# Altium project gadapter.PrjPcb
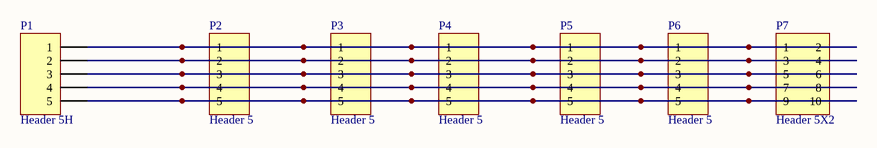
[diagram p0: gadapter.SchDoc]
1 sheet, 7 parts. Net scope: global (net labels, ports and power ports of the same name join across sheets).
Board file: gadapter.PcbDoc

## Sheet gadapter.SchDoc
size A4

### Parts
P1  Header 5H  [HDR1X5H]
P2  Header 5  [HDR1X5]
P3  Header 5  [HDR1X5]
P4  Header 5  [HDR1X5]
P5  Header 5  [HDR1X5]
P6  Header 5  [HDR1X5]
P7  Header 5X2  [HDR2X5]

### Nets
NetP1_1: P1.1 P2.1 P3.1 P4.1 P5.1 P6.1 P7.1 P7.2
NetP1_2: P1.2 P2.2 P3.2 P4.2 P5.2 P6.2 P7.3 P7.4
NetP1_3: P1.3 P2.3 P3.3 P4.3 P5.3 P6.3 P7.5 P7.6
NetP1_4: P1.4 P2.4 P3.4 P4.4 P5.4 P6.4 P7.7 P7.8
NetP1_5: P1.5 P2.5 P3.5 P4.5 P5.5 P6.5 P7.9 P7.10

### Library data of the parts
P1 = Header 5H: Header, 5-Pin, Right Angle; LatestRevisionDate: 17-Jul-2002; LatestRevisionNote: Re-released for DXP Platform.; Publisher: Altium Limited
P2-P6 = Header 5: Header, 5-Pin; LatestRevisionDate: 17-Jul-2002; LatestRevisionNote: Re-released for DXP Platform.; Publisher: Altium Limited
P7 = Header 5X2: Header, 5-Pin, Dual row; LatestRevisionDate: 17-Jul-2002; LatestRevisionNote: Re-released for DXP Platform.; Publisher: Altium Limited